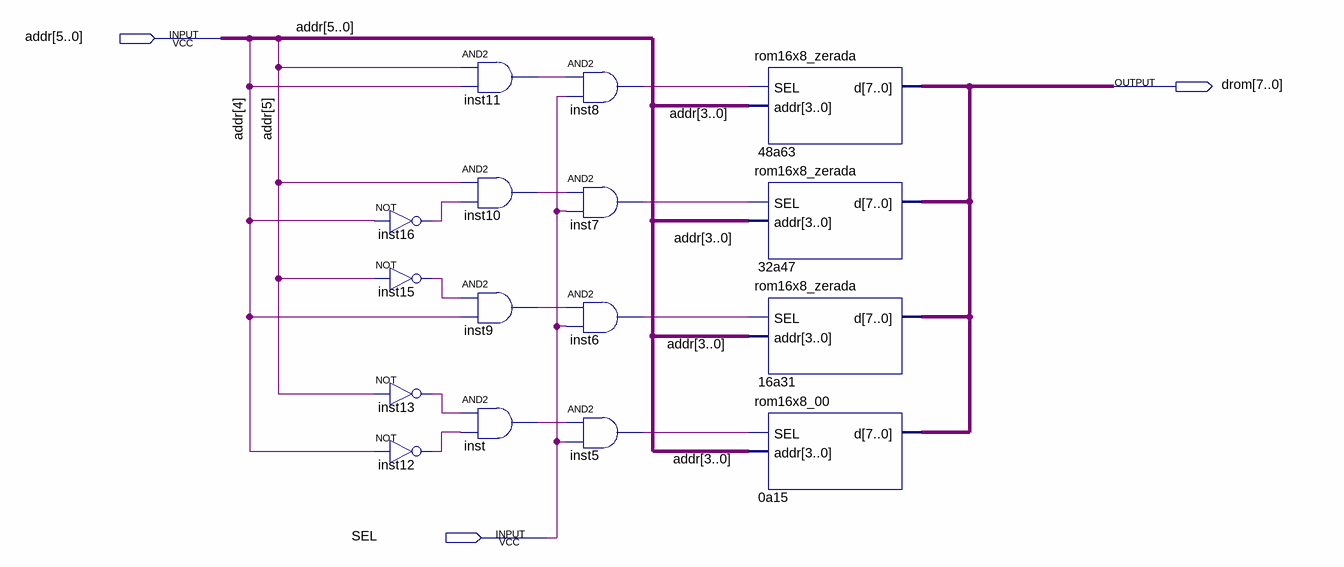
[diagram p0: schematic sheet]
// Quartus schematic rom64x8_0.bdf as structural Verilog: 16 symbols, 3 pins
module rom64x8_0 (
  input  [5:0] addr,
  input  SEL,
  output [7:0] drom
);

  wire inst5_out, inst6_out, inst7_out, inst8_out, inst9_out, inst10_out, inst11_out, inst12_out, inst13_out,
       inst15_out, inst16_out, inst_out;

  not inst16 (inst16_out, addr[4]);
  not inst15 (inst15_out, addr[5]);
  not inst13 (inst13_out, addr[5]);
  not inst12 (inst12_out, addr[4]);
  and inst11 (inst11_out, addr[5], addr[4]);
  and inst10 (inst10_out, addr[5], inst16_out);
  and inst9 (inst9_out, inst15_out, addr[4]);
  and inst (inst_out, inst13_out, inst12_out);
  and inst8 (inst8_out, inst11_out, SEL);
  and inst7 (inst7_out, inst10_out, SEL);
  and inst6 (inst6_out, inst9_out, SEL);
  and inst5 (inst5_out, inst_out, SEL);
  rom16x8_zerada u_48a63 (.SEL(inst8_out), .addr(addr[3:0]), .d(drom));
  rom16x8_zerada u_32a47 (.SEL(inst7_out), .addr(addr[3:0]), .d(drom));
  rom16x8_zerada u_16a31 (.SEL(inst6_out), .addr(addr[3:0]), .d(drom));
  rom16x8_00 u_0a15 (.SEL(inst5_out), .addr(addr[3:0]), .d(drom));
endmodule
